# EAGLE board v1.0 (EAGLE 8.2.1), part 1 of 2
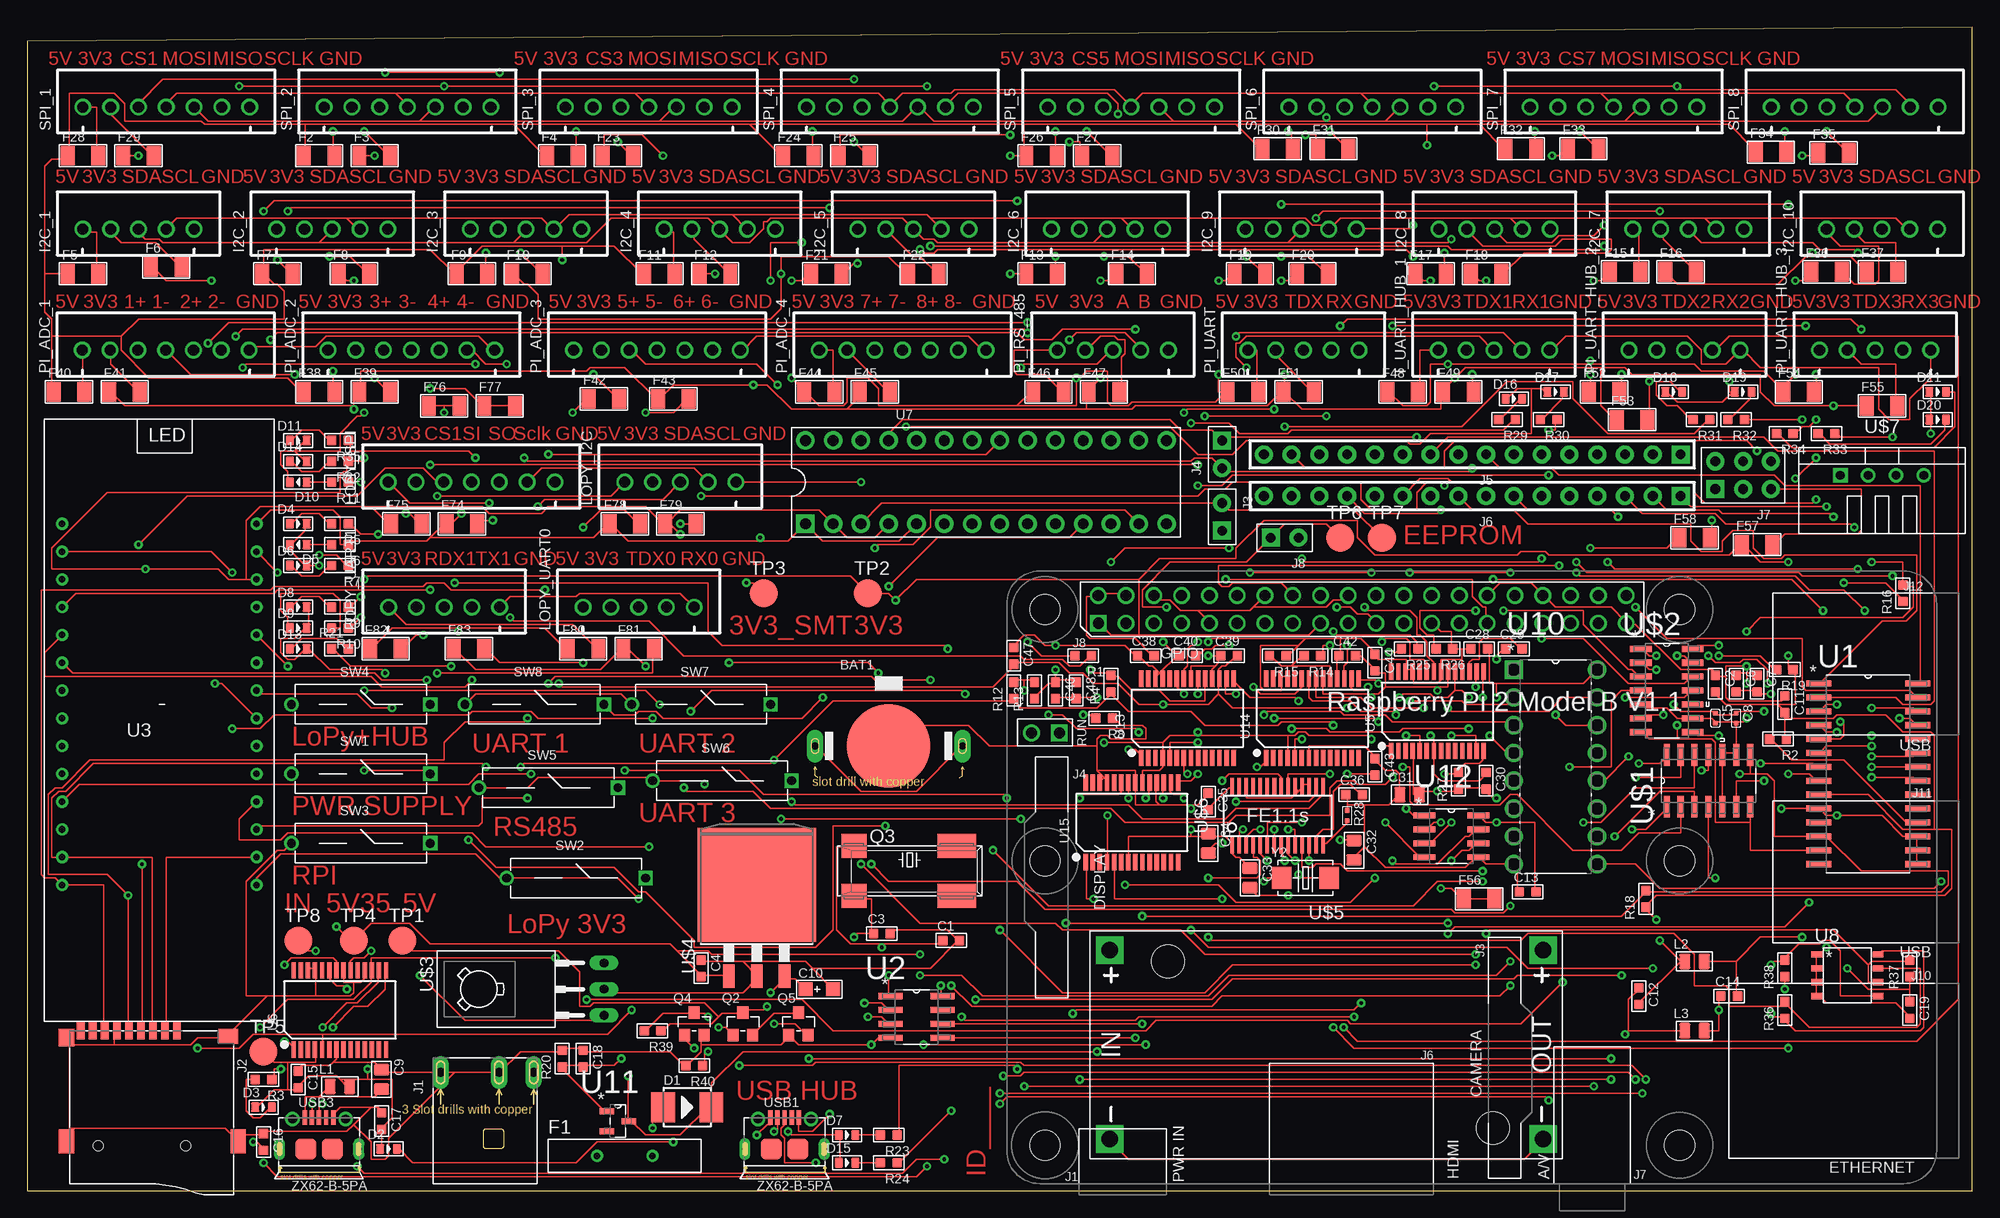
[diagram p9: board, top side]
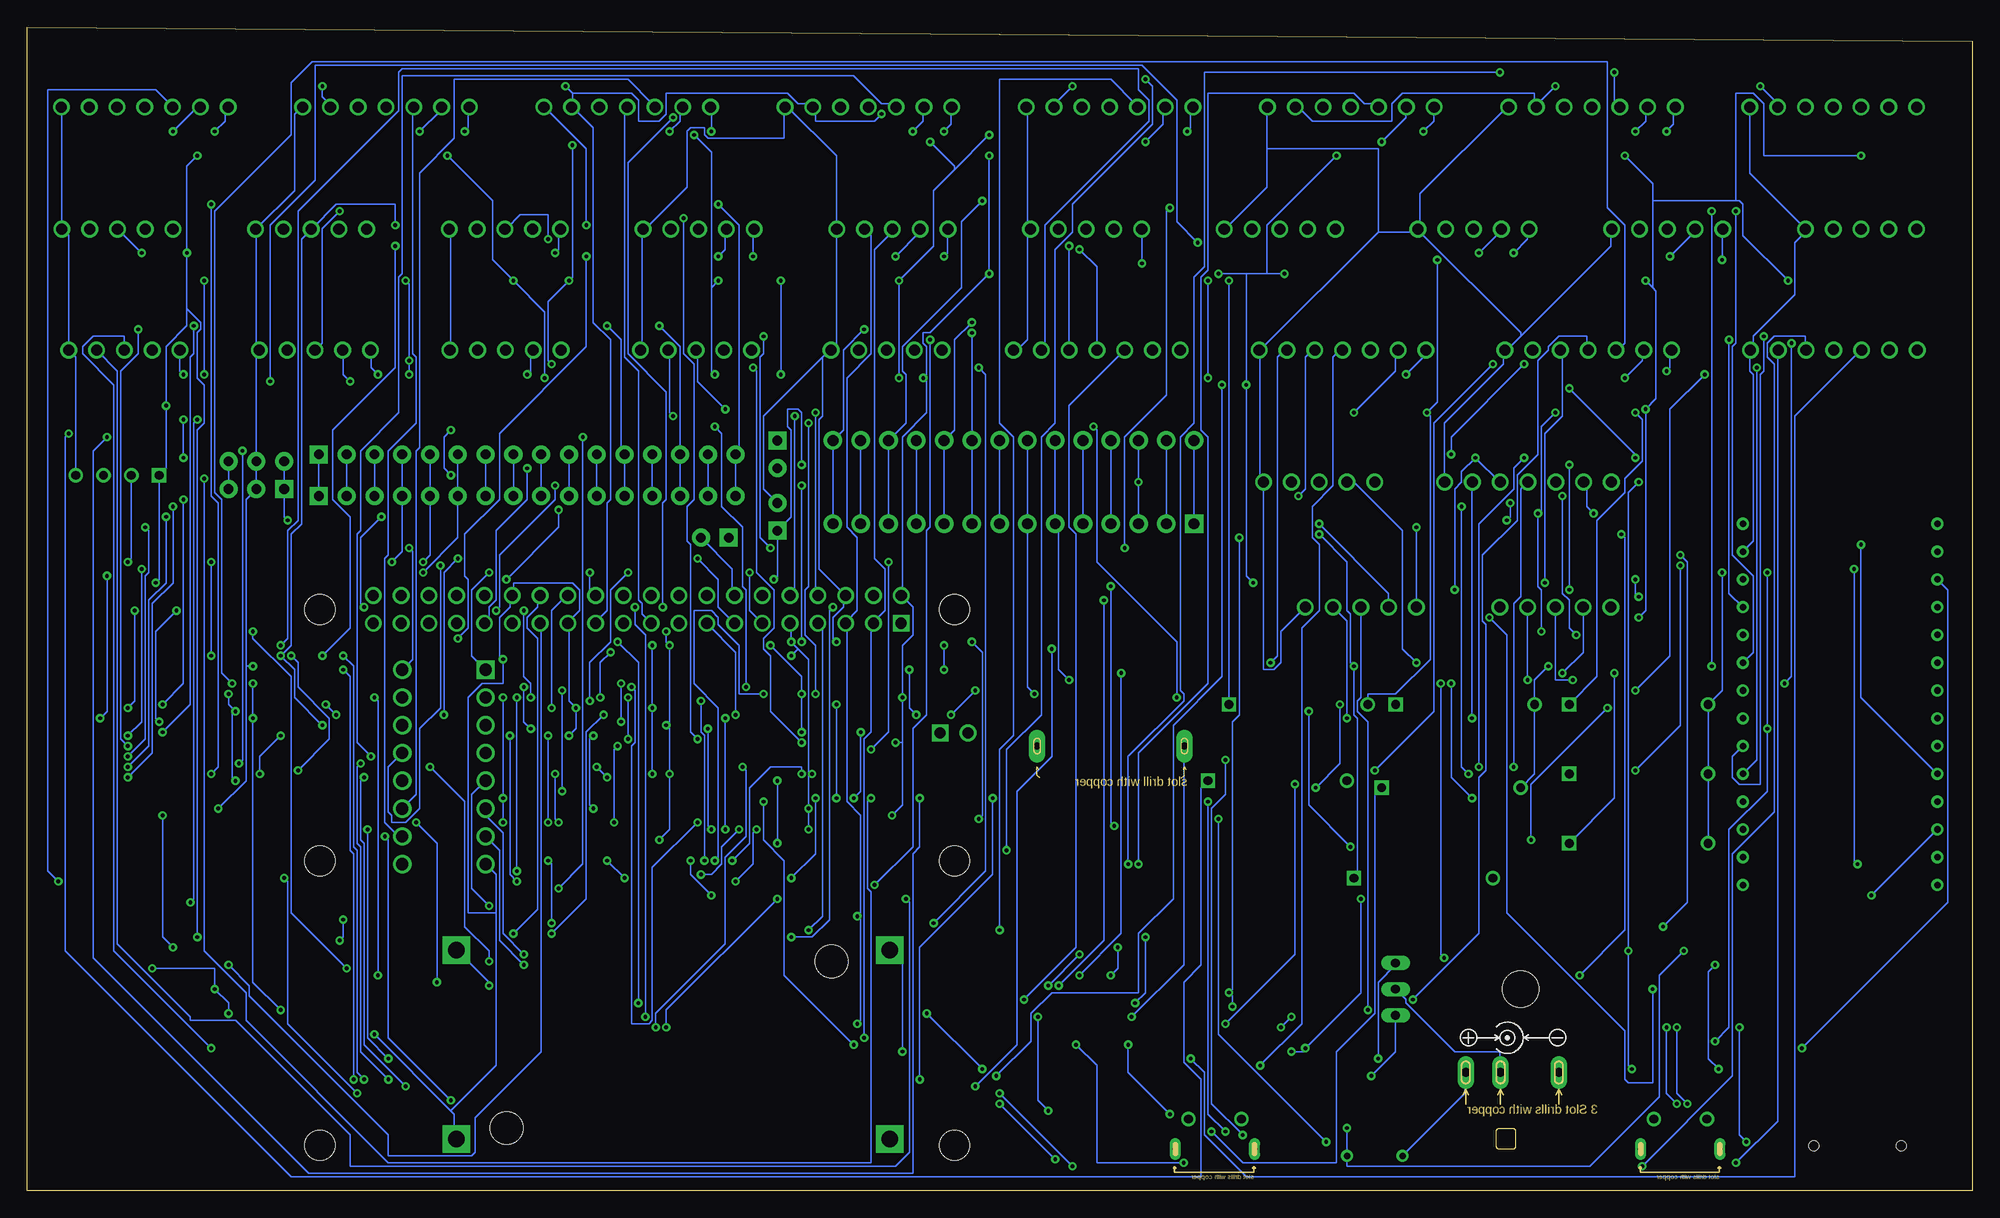
[diagram p10: board, bottom side, seen from below]

Size 177.78 x 106.35 mm. Coordinates in mm from the lower left corner, seen from the top.
Outline: 0,0 177.78,0 177.78,106.35 0,105.08 0,0
Copper layers (1*16): Top 0.035mm / dielectric 1.5mm / Bottom 0.035mm
Design rules "default": minimum track width 6mil, minimum drill 0.35mm, track to track 6mil, track to pad 6mil, pad to pad 6mil, via to via 6mil, smd to smd 6mil, copper to edge 40mil, drill to drill 6mil, minimum pad ring 10mil, minimum via ring 8mil, stop-mask expansion 4mil, vias tented up to drill 0mil, thermal gap 10mil

## Footprints (pad centres in the part's own frame; a part is rotated, then mirrored left to right if it is on the bottom)
BAT2P-13.5-CR1220 = drill 0.635 pad 1.524 long: +1 6.731,0; +2 -6.731,0 | smd 7.62 x 7.62: - 0,0
C0603 = smd 0.889 x 0.889: 1 0,0.762; 2 0,-0.762
C0402 = smd 0.5 x 0.5: 1 0,0.463; 2 0,-0.463
C0805 = smd 1.397 x 1.016: 1 0,0.889; 2 0,-0.889
AVX-A = smd 1.27 x 1.27: + -1.27,0; - 1.27,0
DO-214AA = smd 2.159 x 2.743: + -2.21,0; - 2.21,0
LED-0603 = smd 0.762 x 0.889: + -0.762,0; - 0.762,0
TH_5MM_14MM = drill 0.6: P$1 -2.54,0; P$2 2.54,0
F1206 = smd 1.27 x 1.778: 1 -1.397,0; 2 1.397,0
JST-XH-05-PACKAGE-ROUND-PAD = drill 1.016: 1 -5.08,0; 2 -2.54,0; 3 0,0; 4 2.54,0; 5 5.08,0
DCJ3P-11.6X9.6X7.0MM = drill 0.813 pad 1.524 long: + 4.381,10.16; - -4.128,10.16; CDN 1.206,10.16
MICRO-SD9+4P-SMD-16.1X14.5X1.85MM = smd 1.6 x 0.7: 1 0,2.25; 2 0,1.15; 3 0,0.05; 4 0,-1.05; 5 0,-2.15; 6 0,-3.25; 7 0,-4.35; 8 0,-5.45; 9 0,-6.55 | smd 1.6 x 1.4: G1 0.6,-7.85 | smd 2.2 x 1.4: G2 10.1,-7.85; G3 10.1,7.85 | smd 1.4 x 1.8: G4 0.5,6.95 | hole 0.9: 10.5,-4.95; 10.5,3.05
H2-2.54 = drill 0.889 pad 1.651 square: 1 0,1.27 | drill 0.889 pad 1.651: 2 0,-1.27
H16-2.54 = drill 0.889 pad 1.651 square: 1 0,-19.05 | drill 0.889 pad 1.651: 2 0,-16.51; 3 0,-13.97; 4 0,-11.43; 5 0,-8.89; 6 0,-6.35; 7 0,-3.81; 8 0,-1.27; 9 0,1.27; 10 0,3.81; 11 0,6.35; 12 0,8.89; 13 0,11.43; 14 0,13.97; 15 0,16.51; 16 0,19.05
H2X3-2.54 = drill 0.889 pad 1.651 square: 1 -1.27,2.54 | drill 0.889 pad 1.651: 2 -1.27,0; 3 -1.27,-2.54; 4 1.27,-2.54; 5 1.27,0; 6 1.27,2.54
L0805 = smd 1.016 x 1.397: 1 -0.889,0; 2 0.889,0
JST-XH-07-PACKAGE-ROUND-PAD = drill 1.016: 1 -7.62,0; 2 -5.08,0; 3 -2.54,0; 4 0,0; 5 2.54,0; 6 5.08,0; 7 7.62,0
RPI2 = drill 1.016 square: P$1 8.37,51.23; P$41 4.8,41.2 | drill 1.016: P$2 8.357,53.772; P$3 10.897,51.232; P$4 10.897,53.772; P$5 13.437,51.232; P$6 13.437,53.772; P$7 15.977,51.232; P$8 15.977,53.772; P$9 18.517,51.232; P$10 18.517,53.772; P$11 21.057,51.232; P$12 21.057,53.772; P$13 23.597,51.232; P$14 23.597,53.772; P$15 26.137,51.232; P$16 26.137,53.772; P$17 28.677,51.232; P$18 28.677,53.772; P$19 31.217,51.232; P$20 31.217,53.772; P$21 33.757,51.232; P$22 33.757,53.772; P$23 36.297,51.232; P$24 36.297,53.772; P$25 38.837,51.232; P$26 38.837,53.772; P$27 41.377,51.232; P$28 41.377,53.772; P$29 43.917,51.232; P$30 43.917,53.772; P$31 46.457,51.232; P$32 46.457,53.772; P$33 48.997,51.232; P$34 48.997,53.772; P$35 51.537,51.232; P$36 51.537,53.772; P$37 54.077,51.232; P$38 54.077,53.772; P$39 56.617,51.232; P$40 56.617,53.772; P$42 2.26,41.2 | hole 2.75: 3.5,3.5; 61.5,3.5; 3.5,52.5; 61.5,52.5; 61.5,29.5; 3.5,29.5
SOT-23 = smd 1.016 x 1.143: 1 -0.889,-1.016; 2 0.889,-1.016; 3 0,1.016
86SMX = smd 2.286 x 2.184: 1 -5.08,-2.286; 4 -5.08,2.286 | smd 3.556 x 2.184: 2 4.318,-2.286; 3 4.318,2.286
R0603 = smd 0.889 x 0.889: 1 0,0.762; 2 0,-0.762
R0402 = smd 0.5 x 0.5: 1 0,0.463; 2 0,-0.463
SW2-12.7-12.0X3.6X3.6MM = drill 0.8 square: 1 6.35,0 | drill 0.8: 2 -6.35,0
B2,54 = smd 2.54 x 2.54: TP 0,0
SOIC127P1032X265-28N = smd 2.286 x 0.559: 1 -4.521,8.255; 2 -4.521,6.985; 3 -4.521,5.715; 4 -4.521,4.445; 5 -4.521,3.175; 6 -4.521,1.905; 7 -4.521,0.635; 8 -4.521,-0.635; 9 -4.521,-1.905; 10 -4.521,-3.175; 11 -4.521,-4.445; 12 -4.521,-5.715; 13 -4.521,-6.985; 14 -4.521,-8.255; 15 4.521,-8.255; 16 4.521,-6.985; 17 4.521,-5.715; 18 4.521,-4.445; 19 4.521,-3.175; 20 4.521,-1.905; 21 4.521,-0.635; 22 4.521,0.635; 23 4.521,1.905; 24 4.521,3.175; 25 4.521,4.445; 26 4.521,5.715; 27 4.521,6.985; 28 4.521,8.255
SOIC127P600X175-8N = smd 2.184 x 0.559: 1 -2.362,1.905; 2 -2.362,0.635; 3 -2.362,-0.635; 4 -2.362,-1.905; 5 2.362,-1.905; 6 2.362,-0.635; 7 2.362,0.635; 8 2.362,1.905
LOPY = drill 0.6: P$1 -8.89,16.51; P$2 -8.89,13.97; P$3 -8.89,11.43; P$4 -8.89,8.89; P$5 -8.89,6.35; P$6 -8.89,3.81; P$7 -8.89,1.27; P$8 -8.89,-1.27; P$9 -8.89,-3.81; P$10 -8.89,-6.35; P$11 -8.89,-8.89; P$12 -8.89,-11.43; P$13 -8.89,-13.97; P$14 -8.89,-16.51; P$15 8.89,-16.51; P$16 8.89,-13.97; P$17 8.89,-11.43; P$18 8.89,-8.89; P$19 8.89,-6.35; P$20 8.89,-3.81; P$21 8.89,-1.27; P$22 8.89,1.27; P$23 8.89,3.81; P$24 8.89,6.35; P$25 8.89,8.89; P$26 8.89,11.43; P$27 8.89,13.97; P$28 8.89,16.51
SSOP28-0.65-10.2X5.2MM = smd 0.4 x 1.5: 1 -4.225,-3.625; 2 -3.575,-3.625; 3 -2.925,-3.625; 4 -2.275,-3.625; 5 -1.625,-3.625; 6 -0.975,-3.625; 7 -0.325,-3.625; 8 0.325,-3.625; 9 0.975,-3.625; 10 1.625,-3.625; 11 2.275,-3.625; 12 2.925,-3.625; 13 3.575,-3.625; 14 4.225,-3.625; 15 4.225,3.625; 16 3.575,3.625; 17 2.925,3.625; 18 2.275,3.625; 19 1.625,3.625; 20 0.975,3.625; 21 0.325,3.625; 22 -0.325,3.625; 23 -0.975,3.625; 24 -1.625,3.625; 25 -2.275,3.625; 26 -2.925,3.625; 27 -3.575,3.625; 28 -4.225,3.625
SCK28-2.54-35.6X10MM = drill 1 pad 1.7 square: 1 -16.51,-3.81 | drill 1 pad 1.7: 2 -13.97,-3.81; 3 -11.43,-3.81; 4 -8.89,-3.81; 5 -6.35,-3.81; 6 -3.81,-3.81; 7 -1.27,-3.81; 8 1.27,-3.81; 9 3.81,-3.81; 10 6.35,-3.81; 11 8.89,-3.81; 12 11.43,-3.81; 13 13.97,-3.81; 14 16.51,-3.81; 15 16.51,3.81; 16 13.97,3.81; 17 11.43,3.81; 18 8.89,3.81; 19 6.35,3.81; 20 3.81,3.81; 21 1.27,3.81; 22 -1.27,3.81; 23 -3.81,3.81; 24 -6.35,3.81; 25 -8.89,3.81; 26 -11.43,3.81; 27 -13.97,3.81; 28 -16.51,3.81
SOP8 = smd 1 x 0.5: 1 -2.8,1.905; 2 -2.8,0.635; 3 -2.8,-0.635; 4 -2.8,-1.905; 5 2.8,-1.905; 6 2.8,-0.635; 7 2.8,0.635; 8 2.8,1.905
DIP254P762X420-16 = drill 1.118 square: 1 -7.62,17.78 | drill 1.118: 2 -7.62,15.24; 3 -7.62,12.7; 4 -7.62,10.16; 5 -7.62,7.62; 6 -7.62,5.08; 7 -7.62,2.54; 8 -7.62,0; 9 0,0; 10 0,2.54; 11 0,5.08; 12 0,7.62; 13 0,10.16; 14 0,12.7; 15 0,15.24; 16 0,17.78
SOT91P240X110-3N = smd 1.321 x 0.559: 1 -1.016,0.914; 2 -1.016,-0.914; 3 1.016,0
SOIC127P600X175-8N' = smd 1.981 x 0.533: 1 -2.464,1.905; 2 -2.464,0.635; 3 -2.464,-0.635; 4 -2.464,-1.905; 5 2.464,-1.905; 6 2.464,-0.635; 7 2.464,0.635; 8 2.464,1.905
SOIC127P600X175-14N = smd 1.981 x 0.559: 1 -2.362,3.81; 2 -2.362,2.54; 3 -2.362,1.27; 4 -2.362,0; 5 -2.362,-1.27; 6 -2.362,-2.54; 7 -2.362,-3.81; 8 2.362,-3.81; 9 2.362,-2.54; 10 2.362,-1.27; 11 2.362,0; 12 2.362,1.27; 13 2.362,2.54; 14 2.362,3.81
TO-225AA = drill 0.813 long: 1 -4.921,-8.89; 2 -2.54,-8.89; 3 -0.159,-8.89 | hole 3.302: -2.54,2.54
TO-263 = smd 1.067 x 2.159: 1 -2.54,-8.331; 2 0,-8.331; 3 2.54,-8.331 | smd 10.8 x 10.41: TAB 0,0
DC-DC-STEP-DOWN-LM2596 = drill 1.5 pad 2.5 square: IN+ -19.812,8.636; IN- -19.812,-8.636; OUT+ 19.812,8.636; OUT- 19.812,-8.636 | hole 3: -14.478,7.62; 15.24,-7.62
FE1.1S_SSOP-28 = smd 0.35 x 1.5: 1 -4.16,-2.7; 2 -3.52,-2.7; 3 -2.88,-2.7; 4 -2.24,-2.7; 5 -1.6,-2.7; 6 -0.96,-2.7; 7 -0.32,-2.7; 8 0.32,-2.7; 9 0.96,-2.7; 10 1.6,-2.7; 11 2.24,-2.7; 12 2.88,-2.7; 13 3.52,-2.7; 14 4.16,-2.7; 15 4.16,2.7; 16 3.52,2.7; 17 2.88,2.7; 18 2.24,2.7; 19 1.6,2.7; 20 0.96,2.7; 21 0.32,2.7; 22 -0.3,2.7; 23 -0.96,2.7; 24 -1.6,2.7; 25 -2.24,2.7; 26 -2.88,2.7; 27 -3.52,2.7; 28 -4.16,2.7
TEMP-HUM-SENSOR-DHT22 = drill 0.8 square: 1 -3.81,0 | drill 0.8: 2 -1.27,0; 3 1.27,0; 4 3.81,0
MICRO-USB5+6P-SMD-0.65-AB = smd 0.4 x 1.35: 1 -1.3,2.875; 2 -0.65,2.875; 3 0,2.875; 4 0.65,2.875; 5 1.3,2.875 | smd 1.9 x 1.9: P1 -1.2,0; P2 1.2,0 | drill 0.508 pad 1.016 long: P3 -3.625,0; P4 3.625,0 | drill 0.8: P5 -2.425,2.73; P6 2.425,2.73
X2-SMD-5.0X3.2X1.3MM = smd 1.778 x 2.032: 1 -2.159,0; 2 2.159,0

## Placement (x,y rotation side)
BAT1  cr1220  [BAT2P-13.5-CR1220]  78.74,40.64 0 top
C1  10pf  [C0603]  84.45,22.86 90 top
C2  100nf  [C0603]  154.31,46.35 0 top
C3  10pf  [C0603]  78.11,23.5 90 top
C4  10uf  [C0603]  61.59,20.32 0 top
C5  1UF 6.3V  [C0402]  154.31,43.18 0 top
C6  100nf  [C0603]  156.21,46.35 0 top
C7  100nf  [C0603]  158.12,46.35 0 top
C8  1UF 6.3V  [C0402]  156.21,43.18 0 top
C9  10nf  [C0805]  32.38,10.16 0 top
C10  10uf  [AVX-A]  72.39,18.41 0 top
C11  100nf  [C0603]  160.66,44.45 0 top
C12  100nf  [C0603]  147.32,17.78 0 top
C13  100nf  [C0603]  137.16,27.3 90 top
C14  100nf  [C0603]  155.57,17.78 90 top
C15  100nf  [C0603]  24.77,10.16 0 top
C16  100nf  [C0603]  21.59,4.45 0 top
C17  4.7uf  [C0603]  32.38,6.35 0 top
C18  100nf  [C0603]  50.8,12.06 0 top
C19  100nf  [C0603]  172.09,16.51 0 top
C28  100nf  [C0603]  132.72,49.53 90 top
C29  100nf  [C0603]  135.89,49.53 90 top
C30  4.7uf  [C0603]  133.35,37.47 0 top
C31  100nf  [C0805]  126.36,36.2 90 top
C32  10uf  [C0805]  121.28,31.11 0 top
C33  10uf  [C0805]  111.76,28.57 0 top
C34  10uf  [C0805]  107.95,31.75 0 top
C35  100nf  [C0603]  107.95,35.56 0 top
C36  100nf  [C0603]  121.28,36.2 90 top
C38  100nf  [C0603]  102.23,48.9 90 top
C39  100nf  [C0603]  109.86,48.9 90 top
C40  4.7uf  [C0603]  106.05,48.9 90 top
C42  100nf  [C0603]  120.65,48.9 90 top
C43  100nf  [C0603]  123.19,38.73 0 top
C44  4.7uf  [C0603]  123.19,48.26 0 top
C46  100nf  [C0603]  93.98,45.72 0 top
C47  100nf  [C0603]  90.17,48.9 0 top
C48  4.7uf  [C0603]  95.89,45.72 0 top
D1  28V-5A  [DO-214AA]  60.33,7.62 0 top
D2  BLUE-0603  [LED-0603]  33.02,3.81 0 top
D3  GREEN-0603  [LED-0603]  21.59,7.62 0 top
D4  RED-0603  [LED-0603]  24.77,60.96 0 top
D5  RED-0603  [LED-0603]  24.77,59.05 180 top
D6  RED-0603  [LED-0603]  24.77,57.15 0 top
D7  BLUE-0603  [LED-0603]  74.93,5.08 0 top
D8  RED-0603  [LED-0603]  24.77,53.34 0 top
D9  RED-0603  [LED-0603]  24.77,51.44 0 top
D10  RED-0603  [LED-0603]  24.77,64.77 180 top
D11  BLUE-0603  [LED-0603]  24.77,68.58 0 top
D13  RED-0603  [LED-0603]  24.77,49.53 0 top
D14  RED-0603  [LED-0603]  24.77,66.67 0 top
D15  GREEN-0603  [LED-0603]  74.93,2.54 0 top
D16  BLUE-0603  [LED-0603]  135.89,72.39 0 top
D17  GREEN-0603  [LED-0603]  139.7,73.03 0 top
D18  BLUE-0603  [LED-0603]  150.5,73.03 0 top
D19  GREEN-0603  [LED-0603]  156.84,73.03 0 top
D20  BLUE-0603  [LED-0603]  174.62,70.48 0 top
D21  GREEN-0603  [LED-0603]  174.62,73.03 0 top
F1  307010005_DIP_PPTC_4A_0310  [TH_5MM_14MM]  54.61,3.17 0 top
F2  SMD1206R500SF  [F1206]  26.67,94.61 0 top
F3  SMD1206R500SF  [F1206]  31.75,94.61 0 top
F4  SMD1206R500SF  [F1206]  48.9,94.61 0 top
F5  SMD1206R500SF  [F1206]  5.08,83.82 0 top
F6  SMD1206R500SF  [F1206]  12.7,84.45 0 top
F7  SMD1206R500SF  [F1206]  22.86,83.82 0 top
F8  SMD1206R500SF  [F1206]  29.84,83.82 0 top
F9  SMD1206R500SF  [F1206]  40.64,83.82 0 top
F10  SMD1206R500SF  [F1206]  45.72,83.82 0 top
F11  SMD1206R500SF  [F1206]  57.78,83.82 0 top
F12  SMD1206R500SF  [F1206]  62.87,83.82 0 top
F13  SMD1206R500SF  [F1206]  92.71,83.82 0 top
F14  SMD1206R500SF  [F1206]  100.97,83.82 0 top
F15  SMD1206R500SF  [F1206]  146.05,83.99 0 top
F16  SMD1206R500SF  [F1206]  151.13,83.99 0 top
F17  SMD1206R500SF  [F1206]  128.27,83.82 0 top
F18  SMD1206R500SF  [F1206]  133.35,83.82 0 top
F19  SMD1206R500SF  [F1206]  111.76,83.82 0 top
F20  SMD1206R500SF  [F1206]  117.47,83.82 0 top
F21  SMD1206R500SF  [F1206]  73.03,83.82 0 top
F22  SMD1206R500SF  [F1206]  81.92,83.82 0 top
F23  SMD1206R500SF  [F1206]  53.98,94.61 0 top
F24  SMD1206R500SF  [F1206]  70.48,94.61 0 top
F25  SMD1206R500SF  [F1206]  75.56,94.61 0 top
F26  SMD1206R500SF  [F1206]  92.71,94.61 0 top
F27  SMD1206R500SF  [F1206]  97.79,94.61 0 top
F28  SMD1206R500SF  [F1206]  5.08,94.61 0 top
F29  SMD1206R500SF  [F1206]  10.16,94.61 0 top
F30  SMD1206R500SF  [F1206]  114.3,95.25 0 top
F31  SMD1206R500SF  [F1206]  119.38,95.25 0 top
F32  SMD1206R500SF  [F1206]  136.53,95.25 0 top
F33  SMD1206R500SF  [F1206]  142.24,95.25 0 top
F34  SMD1206R500SF  [F1206]  159.38,94.95 0 top
F35  SMD1206R500SF  [F1206]  165.1,94.87 0 top
F36  SMD1206R500SF  [F1206]  164.47,83.99 0 top
F37  SMD1206R500SF  [F1206]  169.54,83.99 0 top
F38  SMD1206R500SF  [F1206]  26.67,73.03 0 top
F39  SMD1206R500SF  [F1206]  31.75,73.03 0 top
F40  SMD1206R500SF  [F1206]  3.81,73.03 0 top
F41  SMD1206R500SF  [F1206]  8.89,73.03 0 top
F42  SMD1206R500SF  [F1206]  52.7,72.39 0 top
F43  SMD1206R500SF  [F1206]  59.05,72.39 0 top
F44  SMD1206R500SF  [F1206]  72.39,73.03 0 top
F45  SMD1206R500SF  [F1206]  77.47,73.03 0 top
F46  SMD1206R500SF  [F1206]  93.34,73.03 0 top
F47  SMD1206R500SF  [F1206]  98.42,73.03 0 top
F48  SMD1206R500SF  [F1206]  125.73,73.03 0 top
F49  SMD1206R500SF  [F1206]  130.81,73.03 0 top
F50  SMD1206R500SF  [F1206]  111.12,73.03 0 top
F51  SMD1206R500SF  [F1206]  116.2,73.03 0 top
F52  SMD1206R500SF  [F1206]  144.15,73.03 0 top
F53  SMD1206R500SF  [F1206]  146.69,70.48 0 top
F54  SMD1206R500SF  [F1206]  161.93,73.03 0 top
F55  SMD1206R500SF  [F1206]  169.54,71.75 0 top
F56  SMD1206R500SF  [F1206]  132.72,26.67 0 top
F57  SMD1206R500SF  [F1206]  158.12,59.05 0 top
F58  SMD1206R500SF  [F1206]  152.4,59.69 0 top
F74  SMD1206R500SF  [F1206]  39.73,60.96 0 top
F75  SMD1206R500SF  [F1206]  34.65,60.96 0 top
F76  SMD1206R500SF  [F1206]  38.1,71.75 0 top
F77  SMD1206R500SF  [F1206]  43.18,71.75 0 top
F78  SMD1206R500SF  [F1206]  54.61,60.96 0 top
F79  SMD1206R500SF  [F1206]  59.69,60.96 0 top
F80  SMD1206R500SF  [F1206]  50.8,49.53 0 top
F81  SMD1206R500SF  [F1206]  55.88,49.53 0 top
F82  SMD1206R500SF  [F1206]  32.75,49.53 0 top
F83  SMD1206R500SF  [F1206]  40.37,49.53 0 top
I2C_1  JST-XH-05-PIN-ROUND-PAD  [JST-XH-05-PACKAGE-ROUND-PAD]  10.16,87.9 0 top
I2C_2  JST-XH-05-PIN-ROUND-PAD  [JST-XH-05-PACKAGE-ROUND-PAD]  27.87,87.9 0 top
I2C_3  JST-XH-05-PIN-ROUND-PAD  [JST-XH-05-PACKAGE-ROUND-PAD]  45.58,87.9 0 top
I2C_4  JST-XH-05-PIN-ROUND-PAD  [JST-XH-05-PACKAGE-ROUND-PAD]  63.29,87.9 0 top
I2C_5  JST-XH-05-PIN-ROUND-PAD  [JST-XH-05-PACKAGE-ROUND-PAD]  81,87.9 0 top
I2C_6  JST-XH-05-PIN-ROUND-PAD  [JST-XH-05-PACKAGE-ROUND-PAD]  98.71,87.9 0 top
I2C_7  JST-XH-05-PIN-ROUND-PAD  [JST-XH-05-PACKAGE-ROUND-PAD]  151.84,87.9 0 top
I2C_8  JST-XH-05-PIN-ROUND-PAD  [JST-XH-05-PACKAGE-ROUND-PAD]  134.13,87.9 0 top
I2C_9  JST-XH-05-PIN-ROUND-PAD  [JST-XH-05-PACKAGE-ROUND-PAD]  116.42,87.9 0 top
I2C_10  JST-XH-05-PIN-ROUND-PAD  [JST-XH-05-PACKAGE-ROUND-PAD]  169.54,87.9 0 top
I_UART_HUB_1  JST-XH-05-PIN-ROUND-PAD  [JST-XH-05-PACKAGE-ROUND-PAD]  134.07,76.83 0 top
J1  DC-044-A  [DCJ3P-11.6X9.6X7.0MM]  41.91,0.64 0 top
J2  MICROSD-9P  [MICRO-SD9+4P-SMD-16.1X14.5X1.85MM]  11.43,14.61 270 top
J3  2p-2.54  [H2-2.54]  109.22,61.59 180 top
J4  2p-2.54  [H2-2.54]  109.22,67.31 0 top
J5  16p-2.54  [H16-2.54]  132.08,67.31 90 top
J6  16p-2.54  [H16-2.54]  132.08,63.5 90 top
J7  2x3p-2.54  [H2X3-2.54]  156.84,65.41 90 top
J8  2p-2.54  [H2-2.54]  114.94,59.69 90 top
L1  330R-1500MA  [L0805]  28.57,9.53 0 top
L2  330R-1500MA  [L0805]  152.4,20.95 0 top
L3  330R-1500MA  [L0805]  152.4,14.61 0 top
LOPY_I2C  JST-XH-05-PIN-ROUND-PAD  [JST-XH-05-PACKAGE-ROUND-PAD]  59.69,64.77 0 top
LOPY_SPI  JST-XH-07-PIN-ROUND-PAD  [JST-XH-07-PACKAGE-ROUND-PAD]  40.6,64.77 0 top
LOPY_UART0  JST-XH-05-PIN-ROUND-PAD  [JST-XH-05-PACKAGE-ROUND-PAD]  55.88,53.34 0 top
LOPY_UART1  JST-XH-05-PIN-ROUND-PAD  [JST-XH-05-PACKAGE-ROUND-PAD]  38.1,53.34 0 top
PCB1  RPI2  [RPI2]  89.53,0.64 0 top
PI_ADC_1  JST-XH-07-PIN-ROUND-PAD  [JST-XH-07-PACKAGE-ROUND-PAD]  12.64,76.83 0 top
PI_ADC_2  JST-XH-07-PIN-ROUND-PAD  [JST-XH-07-PACKAGE-ROUND-PAD]  35.1,76.83 0 top
PI_ADC_3  JST-XH-07-PIN-ROUND-PAD  [JST-XH-07-PACKAGE-ROUND-PAD]  57.55,76.83 0 top
PI_ADC_4  JST-XH-07-PIN-ROUND-PAD  [JST-XH-07-PACKAGE-ROUND-PAD]  80.01,76.83 0 top
PI_RS_485  JST-XH-05-PIN-ROUND-PAD  [JST-XH-05-PACKAGE-ROUND-PAD]  99.24,76.83 0 top
PI_UART  JST-XH-05-PIN-ROUND-PAD  [JST-XH-05-PACKAGE-ROUND-PAD]  116.66,76.83 0 top
PI_UART_HUB_2  JST-XH-05-PIN-ROUND-PAD  [JST-XH-05-PACKAGE-ROUND-PAD]  151.49,76.83 0 top
PI_UART_HUB_3  JST-XH-05-PIN-ROUND-PAD  [JST-XH-05-PACKAGE-ROUND-PAD]  168.91,76.83 0 top
Q2  SSM3J328R,LF  [SOT-23]  65.41,15.24 0 top
Q3  6pF@32.7680kHz  [86SMX]  80.64,29.21 0 top
Q4  BSS138W-7-F  [SOT-23]  60.96,15.24 0 top
Q5  SSM3J328R,LF  [SOT-23]  70.48,15.24 0 top
R1  330R  [R0603]  96.52,48.9 90 top
R2  10K 1/10W  [R0603]  160.02,41.27 90 top
R3  330R  [R0603]  21.59,10.16 90 top
R4  4.7K  [R0603]  99.06,46.35 0 top
R5  1K  [R0603]  28.57,60.96 90 top
R6  220R  [R0603]  28.57,59.05 90 top
R7  330R  [R0603]  28.57,57.15 90 top
R8  10K  [R0603]  98.42,43.18 90 top
R9  100R  [R0603]  28.57,53.34 90 top
R10  100R  [R0603]  28.57,51.44 90 top
R11  1K  [R0603]  28.57,64.77 90 top
R12  4.7K  [R0603]  90.17,45.72 0 top
R13  10K  [R0603]  92.08,45.72 0 top
R14  4.7K  [R0603]  117.47,48.9 90 top
R15  10K  [R0603]  114.3,48.9 90 top
R16  10K  [R0603]  171.45,54.61 0 top
R18  10K  [R0603]  147.96,26.67 0 top
R19  10K  [R0603]  160.66,47.62 90 top
R20  15K 1/10W  [R0603]  48.9,12.06 0 top
R21  220R  [R0603]  28.57,49.53 270 top
R22  100R  [R0603]  28.57,66.67 90 top
R23  330R  [R0603]  78.74,5.08 90 top
R24  330R  [R0603]  78.74,2.54 90 top
R25  4.7K  [R0603]  126.36,49.53 90 top
R26  10K  [R0603]  129.54,49.53 90 top
R27  10K  [R0603]  130.81,37.47 0 top
R28  2.7K 1/16W  [R0402]  120.65,34.29 0 top
R29  330R  [R0603]  135.25,70.48 90 top
R30  330R  [R0603]  139.06,70.48 90 top
R31  330R  [R0603]  153.03,70.48 90 top
R32  330R  [R0603]  156.21,70.48 90 top
R33  330R  [R0603]  164.47,69.22 90 top
R34  330R  [R0603]  160.66,69.22 90 top
R35  1K  [R0603]  28.57,68.58 90 top
R36  1M  [R0603]  160.66,16.51 0 top
R37  3.9K  [R0603]  172.09,20.32 0 top
R38  3.9K  [R0603]  160.66,20.32 0 top
R39  100K 1/10W  [R0603]  57.15,14.61 90 top
R40  100K 1/10W  [R0603]  60.96,11.43 90 top
SPI_1  JST-XH-07-PIN-ROUND-PAD  [JST-XH-07-PACKAGE-ROUND-PAD]  12.7,99.06 0 top
SPI_2  JST-XH-07-PIN-ROUND-PAD  [JST-XH-07-PACKAGE-ROUND-PAD]  34.75,99.06 0 top
SPI_3  JST-XH-07-PIN-ROUND-PAD  [JST-XH-07-PACKAGE-ROUND-PAD]  56.8,99.06 0 top
SPI_4  JST-XH-07-PIN-ROUND-PAD  [JST-XH-07-PACKAGE-ROUND-PAD]  78.85,99.06 0 top
SPI_5  JST-XH-07-PIN-ROUND-PAD  [JST-XH-07-PACKAGE-ROUND-PAD]  100.9,99.06 0 top
SPI_6  JST-XH-07-PIN-ROUND-PAD  [JST-XH-07-PACKAGE-ROUND-PAD]  122.95,99.06 0 top
SPI_7  JST-XH-07-PIN-ROUND-PAD  [JST-XH-07-PACKAGE-ROUND-PAD]  145,99.06 0 top
SPI_8  JST-XH-07-PIN-ROUND-PAD  [JST-XH-07-PACKAGE-ROUND-PAD]  167.04,99.06 0 top
SW1  SW-200D  [SW2-12.7-12.0X3.6X3.6MM]  30.48,38.1 0 top
SW2  SW-200D  [SW2-12.7-12.0X3.6X3.6MM]  50.16,28.57 0 top
SW3  SW-200D  [SW2-12.7-12.0X3.6X3.6MM]  30.48,31.75 0 top
SW4  SW-200D  [SW2-12.7-12.0X3.6X3.6MM]  30.48,44.45 0 top
SW5  SW-200D  [SW2-12.7-12.0X3.6X3.6MM]  47.62,36.83 0 top
SW6  SW-200D  [SW2-12.7-12.0X3.6X3.6MM]  63.5,37.47 0 top
SW7  SW-200D  [SW2-12.7-12.0X3.6X3.6MM]  61.59,44.45 0 top
SW8  SW-200D  [SW2-12.7-12.0X3.6X3.6MM]  46.35,44.45 0 top
TP1  TPB2,54  [B2,54]  34.29,22.86 0 top
TP2  TPB2,54  [B2,54]  76.83,54.61 0 top
TP3  TPB2,54  [B2,54]  67.31,54.61 0 top
TP4  TPB2,54  [B2,54]  29.84,22.86 0 top
TP5  TPB2,54  [B2,54]  21.59,12.7 0 top
TP6  TPB2,54  [B2,54]  120.02,59.69 0 top
TP7  TPB2,54  [B2,54]  123.83,59.69 0 top
TP8  TPB2,54  [B2,54]  24.77,22.86 0 top
U1  MCP23017-E/SO  [SOIC127P1032X265-28N]  168.28,38.1 0 top
U2  MCP79412-I/SN  [SOIC127P600X175-8N]  81.28,15.88 0 top
U3  LOPY  [LOPY]  12.06,44.45 0 top
U5  FT232RL-SSOP28  [SSOP28-0.65-10.2X5.2MM]  128.91,43.81 0 top
U6  FT232RL-SSOP28  [SSOP28-0.65-10.2X5.2MM]  28.57,16.51 0 top
U7  2x14p-2.54  [SCK28-2.54-35.6X10MM]  87.63,64.77 0 top
U8  BR24G32-3  [SOP8]  166.37,19.68 0 top
U10  74HC139N  [DIP254P762X420-16]  143.51,29.84 0 top
U11  BZX84C30  [SOT91P240X110-3N]  53.98,6.35 0 top
U12  SP483ECN-L  [SOIC127P600X175-8N']  130.18,32.38 0 top
U13  FT232RL-SSOP28  [SSOP28-0.65-10.2X5.2MM]  106.05,43.18 0 top
U14  FT232RL-SSOP28  [SSOP28-0.65-10.2X5.2MM]  117.47,43.18 0 top
U15  FT232RL-SSOP28  [SSOP28-0.65-10.2X5.2MM]  100.97,33.66 0 top
U$1  MCP3424-E/SL  [SOIC127P600X175-14N]  153.67,37.47 90 top
U$2  MCP3424-E/SL  [SOIC127P600X175-14N]  149.86,45.72 0 top
U$3  C106DG  [TO-225AA]  43.81,20.95 90 top
U$4  MCR29300  [TO-263]  66.67,27.94 0 top
U$5  DC-DC-STEP-DOWN-LM2596  [DC-DC-STEP-DOWN-LM2596]  118.75,13.34 0 top
U$6  FE1.1S  [FE1.1S_SSOP-28]  114.3,34.29 0 top
U$7  TEMP-HUM-SENSOR-DHT22  [TEMP-HUM-SENSOR-DHT22]  169.54,65.41 0 top
USB1  ZX62-B-5PA  [MICRO-USB5+6P-SMD-0.65-AB]  69.22,3.81 0 top
USB3  ZX62-B-5PA  [MICRO-USB5+6P-SMD-0.65-AB]  26.67,3.81 0 top
Y2  12MHZ  [X2-SMD-5.0X3.2X1.3MM]  116.84,28.57 0 top

## Tracks (layer width: path | path; a pad name or v marks a point on that pad's centre or on a via)
3V3  (via drill 0.35)
  Top 0.152: R37.2 172.09,18.41 | 172.09,18.41 C19.1 | U8.8 169.23,21.59 169.54,21.91 173.35,21.91 173.35,14.92 173.04,14.61 161.61,14.61 160.66,15.56 R36.2 160.66,15.88 159.7,15.88 v159.38,16.19 | v160.66,18.41 R38.2 | 172.09,18.41 168.28,18.41 v166.37,20.32
  Bottom 0.152: v159.38,16.19 159.38,17.14 v160.66,18.41 160.66,20.32 v166.37,20.32
3V3_PROTECTED
  Top 0.152: J7.3 167.64,64.14 167.64,60.33 167.32,60.01 160.66,60.01 159.7,59.05 F57.2
  Bottom 0.152: J7.3 J7.4
3V3_SMOOTH  (via drill 0.35)
  Top 0.152: 163.19,85.41 166.69,85.41 167.96,84.14 F37.1 | 163.19,85.41 162.56,85.41 160.02,82.87 150.81,82.87 149.86,83.82 F16.1 | 156.21,20.95 156.21,17.78 C14.2 | L2.2 156.21,20.95 | v166.05,55.56 169.86,55.56 171.45,53.98 R16.2 | v162.24,94.61 163.51,94.61 F35.1 | 156.21,20.95 158.43,23.18 v162.24,23.18 | v163.19,85.72 163.19,85.41 | F10.1 44.45,83.82 45.4,82.87 45.72,82.87 46.67,81.92 46.67,79.69 67.94,79.69 68.9,80.64 v68.9,83.82 68.9,85.41 78.74,85.41 80.33,83.82 F22.1 | v62.87,83.82 F12.1 | v58.1,94.61 56.2,96.52 52.7,96.52 52.7,94.61 F23.1 | TP3.TP 66.36,55.56 v65.72,55.56 | v30.48,52.39 29.53,51.44 R10.2 | 29.84,71.75 29.84,73.03 F39.1 30.48,73.03 30.48,74.93 51.12,74.93 51.44,75.25 54.61,75.25 57.47,72.39 F43.1 57.78,72.39 59.05,73.66 v66.36,73.66 67.63,73.66 69.85,71.44 74.93,71.44 | 29.84,71.75 8.89,71.75 7.62,73.03 F41.1 | 29.84,71.75 v29.84,71.44 | v29.84,83.19 29.21,83.19 28.57,83.82 F8.1 | v16.83,83.19 12.7,83.19 11.43,84.45 F6.1 | v10.16,94.61 F29.1 | v31.75,94.61 F3.1 | 74.93,71.44 75.88,72.39 75.88,73.03 F45.1 | 96.84,71.44 96.84,73.03 | 74.93,71.44 96.84,71.44 | 96.84,71.44 100.97,71.44 101.28,71.75 113.35,71.75 114.62,73.03 F51.1 114.94,73.03 | v98.11,83.19 98.74,83.19 99.38,83.82 F14.1 | 96.84,73.03 v98.11,74.3 | 96.84,73.03 F47.1 | v89.85,96.52 74.3,96.52 74.3,94.61 F25.1 | v95.25,95.89 96.2,95.89 96.2,94.61 F27.1 | 129.22,73.03 129.22,71.44 116.52,71.44 114.94,73.03 | v114.62,83.19 115.25,83.19 115.89,83.82 F20.1 | 114.94,73.03 v114.94,74.61 | v133.35,83.19 132.72,83.19 132.08,83.82 F18.1 | 129.22,73.03 v130.49,74.3 131.44,75.25 143.83,75.25 | 129.22,73.03 F49.1 | 143.83,75.25 143.83,71.75 145.1,70.48 F53.1
  Top 0.152: v116.84,96.52 117.79,96.52 117.79,95.25 F31.1 | v139.38,94.61 140.02,94.61 140.65,95.25 F33.1 | F55.1 v165.1,71.75 159.7,71.75 158.43,73.03 158.43,74.61 146.69,74.61 146.05,75.25 143.83,75.25
  Bottom 0.152: v166.05,55.56 165.74,55.88 U$7.1 165.1,66.04 v165.1,71.75 165.1,77.15 163.19,79.06 163.19,80.64 | v162.24,94.61 163.19,93.66 v163.19,85.72 163.19,80.64 | v162.24,23.18 162.24,69.53 161.61,70.17 161.61,73.66 162.24,74.3 162.24,78.42 161.93,78.74 161.93,79.38 163.19,80.64 | v68.9,83.82 66.36,83.82 | 66.36,83.82 64.45,83.82 | 64.45,83.82 v62.87,83.82 | v58.1,94.61 64.45,88.27 64.45,83.82 | v65.72,55.56 66.36,56.2 v66.36,73.66 66.36,83.82 | v30.48,52.39 29.84,53.02 v29.84,71.44 28.89,72.39 28.89,82.23 29.21,82.55 | 29.21,82.55 v29.84,83.19 | v16.83,83.19 20.95,87.31 20.95,90.17 21.27,90.49 21.59,90.49 | 29.21,90.49 21.59,90.49 | 29.21,82.55 29.21,90.49 | v10.16,94.61 19.05,94.61 19.05,99.38 20,100.33 21.59,100.33 21.59,90.49 | v31.75,94.61 29.21,92.08 29.21,90.49 | v98.11,74.3 v98.11,83.19 94.93,86.36 94.93,91.44 93.03,93.34 | 93.03,93.34 v89.85,96.52 | v95.25,95.89 93.03,93.66 93.03,93.34 | 115.25,82.55 v114.62,83.19 | 115.25,82.55 115.25,74.93 v114.94,74.61 | v130.49,74.3 130.49,80.33 v133.35,83.19 135.25,85.09 135.25,90.49 v139.38,94.61 | v116.84,96.52 115.25,94.93 115.25,82.55
5V35  (via drill 0.35)
  Top 0.152: 61.59,19.68 64.14,19.68 U$4.1 | v26.67,58.1 28.26,58.1 29.21,57.15 R7.2 | v28.26,24.13 29.53,22.86 TP4.TP 31.43,24.45 34.92,24.45 36.83,22.54 58.74,22.54 59.37,21.91 | 59.37,21.91 61.59,19.68 | 61.59,19.68 C4.2 | v135.57,18.73 134.62,17.78 109.22,17.78 108.27,16.83 86.36,16.83 v84.45,18.73 | v81.6,21.59 62.55,21.59 62.23,21.91 59.37,21.91
  Bottom 0.152: v26.67,58.1 26.04,57.47 26.04,26.35 v28.26,24.13 | v135.57,18.73 135.57,19.05 138.43,21.91 U$5.OUT+ | v81.6,21.59 v84.45,18.73
5V_USB_HUB  (via drill 0.35)
  Top 0.152: v119.06,49.85 118.43,49.85 118.43,48.9 R14.2 | v119.38,51.12 119.7,50.8 126.36,50.8 127,50.16 127,49.53 R25.2 | v120.02,32.07 121.28,32.07 C32.1 | v119.06,38.1 115.25,38.1 115.25,37.15 U$6.20 | 90.17,44.77 90.81,44.13 97.79,44.13 99.06,45.4 | v40.96,66.99 40.32,67.63 29.53,67.63 29.53,68.58 R35.2 | v45.09,38.73 45.4,39.05 67.94,39.05 v68.26,39.37 73.66,44.77 90.17,44.77 | 90.17,44.77 R12.2 | v66.67,5.08 67.63,6.03 67.94,6.03 67.94,6.67 USB1.1 | v119.38,42.55 119.06,42.86 114.62,42.86 114.3,42.55 107.63,42.55 106.36,43.81 100.65,43.81 99.06,45.4 | 99.06,45.4 R4.2
  Bottom 0.152: v119.38,51.12 119.38,50.16 v119.06,49.85 119.06,42.55 | v120.02,32.07 119.06,33.02 v119.06,38.1 119.06,42.55 | v40.96,66.99 41.91,66.04 41.91,64.14 45.09,60.96 v45.09,38.73 | v66.67,5.08 69.53,7.94 69.53,34.92 68.26,36.2 v68.26,39.37 | v119.38,42.55 119.06,42.55
+3V3  (via drill 0.35)
  Top 0.152: 160.66,43.18 160.66,41.27 R2.2 | 160.66,43.18 C11.2 160.66,43.81 160.02,44.45 | 160.02,44.45 155.26,44.45 154.31,45.4 C2.2 | 160.02,44.45 161.61,44.45 161.61,47.62 R19.2 160.97,47.62 v160.97,48.9 | v160.97,57.47 158.43,57.47 156.84,59.05 F57.1 156.53,59.05 155.57,58.1 139.06,58.1 138.75,58.42 136.53,58.42 136.21,58.1 123.19,58.1 121.6,59.69 121.6,61.28 113.03,61.28 110.49,58.74 110.49,57.78 103.5,57.78 101.6,55.88 | 151.13,20.95 147.32,17.14 C12.2 | 151.13,20.95 L2.1 151.45,20.95 | 174.31,33.02 171.45,33.02 168.28,36.2 U1.9 | 174.31,33.02 175.9,33.02 175.9,27.62 175.26,26.99 148.91,26.99 147.96,26.04 R18.2 147.96,25.72 v148.91,24.77 | v149.22,22.86 151.13,20.95 | 160.66,43.18 165.1,43.18 165.42,43.5 169.86,43.5 171.45,41.91 173.99,41.91 174.31,41.59 174.31,33.02 | 101.6,50.8 117.16,50.8 118.11,51.75 PCB1.P$17 | 101.6,50.8 99.06,50.8 98.11,51.75 PCB1.P$1 | v30.48,54.29 29.53,53.34 R9.2 | v30.8,55.88 31.11,56.2 75.25,56.2 TP2.TP 78.74,54.61 v79.38,53.98 81.28,55.88 101.6,55.88 | v83.5,18.73 83.5,17.78 U2.8 | 101.6,55.88 101.6,50.8
  Bottom 0.152: v160.97,48.9 v160.97,57.47 | v149.22,22.86 148.91,23.18 v148.91,24.77 | v30.48,54.29 30.8,54.61 v30.8,55.88 | v83.5,18.73 79.38,22.86 v79.38,53.98
+3V3_SMOOTH  (via drill 0.35)
  Top 0.152: C6.2 156.21,45.72 158.12,45.72 C7.2 158.12,45.4 v159.38,45.4 | v158.75,43.81 156.21,43.81 C8.1 156.21,43.5 154.31,43.5 C5.1 154.31,43.81 151.13,43.81 v150.5,44.45 | U$1.6 156.21,37.47 v158.75,37.47 | v149.54,43.5 147.96,43.5 147.64,43.18 U$2.6
  Bottom 0.152: 159.07,44.13 159.38,44.45 v159.38,45.4 | 159.07,44.13 v158.75,43.81 | v158.75,37.47 159.07,37.78 159.07,44.13 | v150.5,44.45 v149.54,43.5
+5V  (via drill 0.35)
  Top 0.152: C10.+ 70.17,19.37 69.22,19.37 | 63.18,15.88 63.5,16.19 65.41,16.19 Q2.3 65.41,16.51 67.31,16.51 v67.63,16.83 | 63.18,15.88 62.55,15.24 58.74,15.24 58.1,14.61 R39.2 | TP1.TP 35.24,21.91 48.58,21.91 50.48,20 50.48,16.83 51.44,16.83 51.75,17.14 61.91,17.14 63.18,15.88 | v67.94,18.1 69.22,19.37 | 69.22,19.37 U$4.3 | U7.5 79.69,59.37 72.71,59.37 U7.1 69.53,59.37 66.99,59.37 | 39.37,51.44 47.31,51.44 49.21,49.53 F80.1 | 39.37,51.44 33.34,51.44 31.43,49.53 F82.1 | F76.2 38.1,71.75 | 38.1,71.75 F76.1 | 36.83,59.69 38.1,60.96 F74.1 38.73,60.96 v39.69,61.91 | 36.83,59.69 36.51,59.37 29.84,59.37 29.53,59.05 R6.2 28.57,59.05 28.57,61.59 27.94,62.23 22.23,62.23 U3.P$28 | 36.83,59.69 51.75,59.69 53.02,60.96 F78.1 53.34,60.96 54.93,59.37 66.99,59.37 | v38.1,71.12 38.1,71.75 | v39.37,51.12 39.37,51.44 | 66.99,59.37 v66.99,59.69
  Bottom 0.152: v67.63,16.83 67.63,17.78 v67.94,18.1 67.63,18.41 67.63,42.86 66.99,43.5 v66.99,59.69 | U7.28 U7.1 | U7.24 U7.5 | v38.1,71.12 39.37,69.85 39.37,62.23 v39.69,61.91 39.69,55.24 39.37,54.93 v39.37,51.12
+24V  (via drill 0.35)
  Top 0.152: v97.79,12.7 65.41,12.7 62.55,9.84 D1.- 62.23,7.62 59.69,5.08 56.52,5.08 55.24,6.35 U11.3 54.93,6.35 v54.93,10.48 | v32.07,60.01 30.48,60.01 29.53,60.96 R5.2 | v35.88,19.68 40.01,15.56 52.39,15.56 52.7,15.88 U$3.1
  Bottom 0.152: v97.79,12.7 97.79,20.95 98.74,21.91 U$5.IN+ | v32.07,60.01 31.75,59.69 31.75,23.81 v35.88,19.68 | v54.93,10.48 52.7,12.7 U$3.1
+24V_UNREG_IN
  Bottom 0.152: F1.P$1 46.35,8.89 46.35,10.79 J1.+
ADC1+  (via drill 0.35)
  Top 0.152: v146.69,33.02 147.96,33.02 149.86,34.92 U$1.1 | v71.44,12.06 v144.78,12.06
  Bottom 0.152: v146.69,33.02 146.69,13.97 v144.78,12.06 | v71.44,12.06 70.17,10.79 70.17,5.08 66.36,1.27 16.19,1.27 16.19,70.8 10.16,76.83 PI_ADC_1.3
ADC1-  (via drill 0.35)
  Top 0.152: U$1.2 151.13,32.7 147.32,32.7 145.73,31.11 141.29,31.11 136.21,36.2 135.57,36.2 134.62,35.24 126.68,35.24 126.36,35.56 126.36,38.73 v125.73,38.73 | v124.78,37.78 124.14,37.15 121.6,37.15 121.28,37.47 119.7,37.47 119.06,36.83 119.06,34.29 110.49,34.29 109.86,33.66 100.33,33.66 99.06,34.92 67.94,34.92 66.36,36.51 60.33,36.51 v60.01,36.83 | v57.78,44.45 56.52,45.72 v30.8,45.72 | v24.45,74.61 14.92,74.61 12.7,76.83 PI_ADC_1.4
  Bottom 0.152: v124.78,37.78 v125.73,38.73 | v60.01,36.83 57.78,39.05 v57.78,44.45 | v30.8,45.72 27.62,48.9 27.62,71.44 v24.45,74.61
ADC2+  (via drill 0.35)
  Top 0.152: U$1.3 152.4,36.51 149.22,36.51 v145.1,32.38 | v139.06,8.26 138.75,8.57 89.53,8.57 v88.9,7.94 | v83.82,2.86 81.28,2.86 80.01,1.59 30.8,1.59 v30.16,2.22
  Bottom 0.152: v145.1,32.38 144.78,32.07 144.78,13.97 v139.06,8.26 | v83.82,2.86 v88.9,7.94 | v30.16,2.22 21.91,10.48 21.91,30.8 18.1,34.61 18.1,75.56 18.73,76.2 18.73,77.47 18.1,78.11 15.24,78.11 15.24,76.83 PI_ADC_1.5
ADC2-  (via drill 0.35)
  Top 0.152: U$1.4 153.67,28.57 v154.31,28.57 | v88.9,8.89 v147.64,8.89 | v82.23,2.22 81.28,1.27 22.86,1.27 v21.59,2.54
  Bottom 0.152: v154.31,28.57 153.99,28.26 153.99,15.24 v147.64,8.89 | v82.23,2.22 v88.9,8.89 | v21.59,2.54 17.78,6.35 17.78,76.83 PI_ADC_1.6
ADC3+  (via drill 0.35)
  Top 0.152: U$1.11 153.67,38.42 v153.03,38.42 | v153.67,48.9 154.31,48.26 156.53,48.26 156.84,48.58 158.12,48.58 159.07,47.62 v159.07,46.35
  Bottom 0.152: v153.03,38.42 150.18,41.27 150.18,43.18 153.03,46.04 153.03,48.26 v153.67,48.9 | v159.07,46.35 160.02,47.31 160.02,63.18 160.66,63.82 160.66,89.53 153.67,96.52 153.67,101.28 151.76,103.19 33.34,103.19 33.34,89.85 31.75,88.27 31.75,77.47 32.38,76.83 PI_ADC_2.3
ADC3-  (via drill 0.35)
  Top 0.152: U$1.12 152.4,36.83 147,36.83 143.83,33.66 v142.24,33.66 | v140.34,19.05 136.53,15.24 120.97,15.24 120.65,15.56 103.19,15.56 102.23,14.61 73.66,14.61 70.8,17.46 v51.12,17.46
  Bottom 0.152: v142.24,33.66 140.34,31.75 v140.34,19.05 | v51.12,17.46 45.09,23.5 45.09,37.78 44.45,38.42 44.45,51.75 44.77,52.07 44.77,58.1 41.59,61.28 41.59,65.41 39.69,67.31 39.69,75.88 38.73,76.83 38.73,77.15 37.78,78.11 35.24,78.11 35.24,76.83 PI_ADC_2.4
ADC4+  (via drill 0.35)
  Top 0.152: U$1.13 151.13,37.78 v147,37.78 | v91.12,9.53 v143.19,9.53 | v84.14,49.53 83.82,49.85 63.5,49.85 62.23,51.12 62.23,55.56 v39.05,55.56
  Bottom 0.152: v147,37.78 147.32,37.47 147.32,32.07 147,31.75 147,13.34 v143.19,9.53 | v91.12,9.53 87.31,13.34 87.31,36.51 84.14,39.69 v84.14,49.53 | v39.05,55.56 39.05,69.22 37.47,70.8 37.47,76.83 PI_ADC_2.5
ADC4-  (via drill 0.35)
  Top 0.152: v147.32,39.05 149.22,39.05 149.86,39.69 U$1.14 | v96.2,10.16 v144.78,10.16 | v89.53,35.88 89.22,36.2 67.31,36.2 65.09,38.42 v54.61,38.42 | v43.81,75.56 41.91,75.56 40.64,76.83 PI_ADC_2.6
  Bottom 0.152: v147.32,39.05 147.64,38.73 147.64,31.75 147.32,31.43 147.32,12.7 v144.78,10.16 | v96.2,10.16 96.2,22.23 89.53,28.89 v89.53,35.88 | v54.61,38.42 49.21,43.81 49.21,70.17 v43.81,75.56
ADC5+  (via drill 0.35)
  Top 0.152: v148.91,48.9 148.27,48.9 147.64,49.53 U$2.1 | v147,10.16 146.37,10.79 91.12,10.79 90.81,10.48 v89.22,10.48 | v68.58,73.66 66.67,75.56 56.52,75.56 55.24,76.83 PI_ADC_3.3
  Bottom 0.152: v148.91,48.9 147.96,47.94 147.96,31.43 147.64,31.11 147.64,10.79 v147,10.16 | v89.22,10.48 86.04,13.65 86.04,16.19 84.14,18.1 76.2,18.1 76.2,23.5 73.03,26.67 73.03,42.55 68.58,46.99 v68.58,73.66
ADC5-  (via drill 0.35)
  Top 0.152: v148.91,47.62 148.27,47.62 147.64,48.26 U$2.2 | v147.96,10.16 146.69,11.43 91.12,11.43 90.81,11.75 72.07,11.75 71.75,11.43 v65.09,11.43
  Bottom 0.152: v148.91,47.62 148.27,46.99 148.27,31.11 147.96,30.8 v147.96,10.16 | v65.09,11.43 61.28,15.24 61.28,51.44 59.69,53.02 59.69,59.05 60.33,59.69 60.33,62.55 58.42,64.45 58.42,76.2 57.78,76.83 PI_ADC_3.4
ADC6+  (via drill 0.35)
  Top 0.152: v134.94,53.02 142.24,53.02 142.24,51.75 146.37,47.62 146.69,47.62 147.32,46.99 U$2.3 | v129.54,64.45 129.22,64.77 127.95,64.77 127,63.82 127,62.23 122.87,62.23 121.92,63.18 121.92,64.77 110.17,64.77 109.54,64.14 107.63,64.14 107,63.5 v61.59,63.5
  Bottom 0.152: v134.94,53.02 134.62,53.34 134.62,58.1 129.54,63.18 v129.54,64.45 | v61.59,63.5 60.96,64.14 60.96,76.2 60.33,76.83 PI_ADC_3.5
ADC6-  (via drill 0.35)
  Top 0.152: U$2.4 145.73,45.72 144.78,44.77 144.78,38.73 v140.97,38.73 | v135.57,20.95 134.3,19.68 109.86,19.68 107.95,17.78 87.31,17.78 85.41,19.68 v81.6,19.68 | v77.79,47.31 76.83,48.26 v64.14,48.26
  Bottom 0.152: v140.97,38.73 137.79,35.56 137.79,24.13 135.57,21.91 v135.57,20.95 | v81.6,19.68 77.79,23.5 v77.79,47.31 | v64.14,48.26 63.5,48.9 63.5,76.2 62.87,76.83 PI_ADC_3.6
ADC7+  (via drill 0.35)
  Top 0.152: v146.05,45.09 151.45,45.09 152.08,45.72 U$2.11 | v145.73,19.68 136.21,19.68 135.89,19.37 110.17,19.37 108.27,17.46 v86.68,17.46
  Bottom 0.152: v146.05,45.09 145.73,44.77 v145.73,19.68 | v86.68,17.46 81.92,22.23 81.92,60.01 82.55,60.64 82.55,71.75 PI_ADC_4.3 | PI_ADC_4.3
ADC7-  (via drill 0.35)
  Top 0.152: v138.43,50.48 142.24,50.48 146.37,46.35 151.45,46.35 152.08,46.99 U$2.12 | v126.68,85.41 126.05,86.04 83.19,86.04 82.87,85.72 81.92,85.72 v81.6,86.04
  Bottom 0.152: v138.43,50.48 137.48,51.44 137.48,55.88 137.79,56.2 137.79,60.01 134.62,63.18 134.62,69.22 126.68,77.15 v126.68,85.41 | v81.6,86.04 80.01,84.45 PI_ADC_4.4 | PI_ADC_4.4
ADC8+  (via drill 0.35)
  Top 0.152: v150.81,48.9 151.45,48.9 152.08,48.26 U$2.13 | v144.15,86.36 143.83,86.04 130.18,86.04 129.86,86.36 v82.55,86.36
  Bottom 0.152: v150.81,48.9 148.27,51.44 148.27,61.59 149.86,63.18 149.86,69.53 144.15,75.25 v144.15,86.36 | PI_ADC_4.5 v82.55,86.36 | PI_ADC_4.5
ADC8-  (via drill 0.35)
  Top 0.152: v154.62,49.85 152.72,49.85 152.4,49.53 U$2.14
  Bottom 0.152: v154.62,49.85 153.99,50.48 153.99,60.33 153.03,61.28 153.03,89.53 143.83,98.74 143.83,102.23 143.51,102.55 76.2,102.55 76.2,100.65 75.25,99.69 75.25,97.79 84.77,88.27 84.77,76.83 PI_ADC_4.6
ADC_1_3V3_P
  Top 0.152: F41.2 10.16,73.03 7.62,75.56 7.62,76.83 PI_ADC_1.2
ADC_1_5V_P
  Top 0.152: F40.2 5.08,73.03 5.08,76.83 PI_ADC_1.1
ADC_2_3V3_P  (via drill 0.35)
  Top 0.152: v31.75,74.3 33.02,73.03 F39.2
  Bottom 0.152: v31.75,74.3 30.16,75.88 30.16,76.83 PI_ADC_2.2
ADC_2_5V_P  (via drill 0.35)
  Top 0.152: v27.94,74.93 27.94,73.03 F38.2
  Bottom 0.152: v27.94,74.93 27.62,75.25 27.62,76.83 PI_ADC_2.1
ADC_3_3V3_P  (via drill 0.35)
  Top 0.152: v56.52,71.12 59.05,71.12 60.33,72.39 F43.2
  Bottom 0.152: v56.52,71.12 52.7,74.93 52.7,76.83 PI_ADC_3.2
ADC_3_5V_P  (via drill 0.35)
  Top 0.152: v51.75,74.61 53.98,72.39 F42.2
  Bottom 0.152: v51.75,74.61 50.16,76.2 50.16,76.83 PI_ADC_3.1
ADC_4_3V3_P
  Top 0.152: PI_ADC_4.2 78.74,73.03 F45.2 | PI_ADC_4.2
ADC_4_5V_P
  Top 0.152: PI_ADC_4.1 73.66,76.83 73.66,73.03 F44.2
FTDI2_3V3
  Top 0.152: C29.2 136.53,49.53 135.57,50.48 133.03,50.48 132.72,50.16 132.72,48.58 132.08,48.58 131.76,48.26 131.76,47.62 U5.17
FTDI2_CBUS1  (via drill 0.35)
  Top 0.152: v90.49,11.11 90.17,11.43 79.69,11.43 79.69,5.08 R23.2 | v95.57,16.19 95.89,16.51 121.28,16.51 v121.92,17.14 | v123.83,50.16 124.14,50.48 126.05,50.48 126.36,50.16 126.36,48.58 127.64,48.58 127.95,48.26 127.95,47.62 U5.23
  Bottom 0.152: v95.57,16.19 v90.49,11.11 | v121.92,17.14 121.92,48.26 v123.83,50.16
FTDI2_RE  (via drill 0.35)
  Top 0.152: U5.14 133.03,40.01 133.03,39.37 132.72,39.05 131.44,39.05 130.81,38.42 R27.1 130.81,38.1 v129.54,38.1 | v129.22,33.66 128.59,33.66 127.95,33.02 U12.2
  Bottom 0.152: v129.22,33.66 129.54,33.97 v129.54,38.1
FTDI2_RXD  (via drill 0.35)
  Top 0.152: v126.05,41.59 127.32,41.59 127.32,40.32 U5.5 | v126.05,34.92 126.68,34.29 U12.1
  Bottom 0.152: v126.05,41.59 126.36,41.27 126.36,35.24 v126.05,34.92
FTDI2_TE  (via drill 0.35)
  Top 0.152: v130.18,41.59 132.4,41.59 132.4,40.32 U5.13 | v130.18,33.66 128.27,31.75 U12.3
  Bottom 0.152: v130.18,33.66 v130.18,41.59
FTDI2_TXD  (via drill 0.35)
  Top 0.152: v123.83,40.64 124.46,40.64 124.78,40.32 U5.1 | v124.14,33.66 127.32,30.48 U12.4
  Bottom 0.152: v123.83,40.64 124.14,40.32 v124.14,33.66
FTDI_3V3  (via drill 0.35)
  Top 0.152: v20.64,4.45 20.95,4.45 21.59,3.81 C16.2 | v21.27,14.92 23.81,17.46 29.84,17.46 31.43,19.05 31.43,20 U6.17 31.43,20.32 31.43,21.27 v48.26,21.27 | 108.9,45.4 107.95,44.45 v103.82,44.45 101.6,44.45 99.69,46.35 97.47,46.35 96.52,47.31 95.25,47.31 94.3,48.26 90.17,48.26 C47.2 90.17,47.94 88.27,46.04 48.9,46.04 v48.58,46.35 | 108.9,45.4 108.9,46.67 U13.17 108.9,46.99 108.9,47.62 109.22,47.94 109.54,47.94 110.49,48.9 C39.2 | v120.65,38.1 123.19,38.1 C43.2 | v120.65,44.13 110.17,44.13 108.9,45.4 | v103.82,35.88 103.82,37.15 U15.17 | v120.65,49.85 120.65,48.26 120.33,47.94 120.33,46.99 U14.17
  Bottom 0.152: v20.64,4.45 21.27,5.08 v21.27,14.92 | v120.65,38.1 v120.65,44.13 v120.65,49.85 | v103.82,44.45 v103.82,35.88 | v48.26,21.27 48.58,21.59 v48.58,46.35
FTID2_CBUS2  (via drill 0.35)
  Top 0.152: v84.45,7.3 79.69,2.54 R24.2 | v85.41,15.88 85.72,15.56 101.28,15.56 101.6,15.88 v121.28,15.88 | v122.24,53.34 122.56,53.02 126.36,53.02 127,52.39 127,50.8 127.32,50.8 127.95,50.16 127.95,48.9 128.59,48.26 128.59,47.62 U5.22
  Bottom 0.152: v84.45,7.3 85.41,8.26 v85.41,15.88 | v121.28,15.88 121.28,50.8 122.24,51.75 v122.24,53.34
GND  (via drill 0.35)
  Top 0.152: 31.43,7.62 28.57,7.62 27.94,6.99 USB3.5 | 31.43,7.62 32.07,7.62 32.38,7.3 C17.1 | 31.43,7.62 29.84,6.03 | 29.84,6.03 29.21,5.4 21.59,5.4 C16.1 21.59,5.08 19.68,5.08 19.37,4.76 J2.G3 19.05,4.76 18.1,5.71 3.81,5.71 | 3.81,5.71 3.81,4.76 J2.G2 | 3.81,5.71 3.81,13.34 | 3.81,13.34 3.81,13.97 J2.G1 3.81,13.34 | 7.94,13.34 7.94,14.61 J2.6 | 3.81,13.34 7.94,13.34 | U6.26 25.72,20.32 26.35,20.32 U6.25 26.35,20 26.35,17.78 | 29.84,19.05 30.48,19.05 30.8,19.37 30.8,20 U6.18 | 29.84,19.05 28.89,19.05 28.89,20 U6.21 | 26.35,17.78 29.53,17.78 29.84,18.1 29.84,19.05 | 21.91,17.78 18.41,14.29 J2.G4 18.1,13.97 15.56,13.97 14.92,13.34 7.94,13.34 | 26.35,17.78 21.91,17.78 | SW3.2 23.5,31.11 22.86,31.11 20,28.26 20,17.78 21.91,17.78 | 85.09,22.86 84.14,23.81 79.38,23.81 79.06,23.5 C3.2 | 65.41,20.95 61.59,20.95 C4.1 | 65.41,20.95 66.67,19.68 U$4.2 66.67,19.37 65.41,18.1 53.02,18.1 U$3.2 | 71.75,20.32 71.12,20.95 65.41,20.95 | 71.75,20.32 C10.- | 85.09,22.86 82.55,20.32 71.75,20.32 | 85.09,22.86 C1.2 | 61.59,13.34 61.59,13.97 Q4.2 | 61.59,13.34 61.59,12.7 60.33,11.43 R40.1 60.01,11.43 58.74,12.7 50.8,12.7 C18.1 50.8,13.02 48.9,13.02 R20.1 48.9,12.7 45.09,12.7 43.18,10.79 J1.CDN 39.05,10.79 | 61.59,13.34 68.9,13.34 69.53,13.97 Q5.1 70.48,13.34 v77.15,13.34 77.79,13.97 U2.4 | v73.34,6.99 71.75,5.4 70.48,5.4 70.48,6.67 USB1.5 | 27.94,11.75 28.26,12.06 28.26,12.7 U6.7 | 27.94,11.75 27.62,11.43 25.08,11.43 24.77,11.11 C15.1 | 27.94,11.75 31.75,11.75 32.38,11.11 C9.1 32.38,10.79 J1.- 39.05,10.79 | 29.84,6.03 31.43,4.45 31.43,2.86 32.7,2.86 33.02,3.17 33.02,4.76 39.05,10.79 | LOPY_UART1.5 44.13,54.29 50.16,54.29 50.48,54.61 59.69,54.61 LOPY_UART0.5
  Top 0.152: PI_ADC_4.7 87.31,76.83 86.04,78.11 66.67,78.11 65.41,76.83 PI_ADC_3.7 | PI_ADC_1.7 20.32,76.83 20.64,77.15 26.35,77.15 27.3,78.11 41.27,78.11 42.55,76.83 PI_ADC_2.7 | U3.P$27 v22.86,56.52 | 103.5,35.24 106.36,35.24 | 106.36,35.24 107,35.24 107.95,36.2 C35.1 | 103.5,35.24 103.19,35.56 103.19,37.15 U15.18 | 103.5,35.24 101.28,35.24 101.28,37.15 U15.21 101.28,37.47 101.28,38.42 97.79,38.42 | 97.79,38.42 97.79,40.64 | 97.79,40.64 97.79,41.27 98.11,41.59 98.74,41.59 99.06,41.27 102.23,41.27 102.23,42.23 101.92,42.55 100.01,42.55 99.38,43.18 R8.2 | 98.42,37.78 98.74,37.47 U15.25 | 98.42,37.78 97.79,38.42 | 98.42,37.78 98.11,37.47 U15.26 | 97.79,40.64 87.95,40.64 86.04,42.55 80.64,42.55 BAT1.- | R13.2 92.08,45.09 93.34,46.35 93.98,46.35 C46.1 93.98,46.67 | 93.98,46.67 95.89,46.67 C48.1 | 103.5,47.31 103.82,46.99 U13.25 | 103.5,47.31 102.87,47.94 102.55,47.94 101.6,48.9 C38.1 101.28,48.9 100.33,49.85 v93.98,49.85 93.03,49.85 92.08,50.8 91.12,50.8 90.17,49.85 C47.1 | 103.5,47.31 105.09,48.9 | 103.5,47.31 103.19,46.99 U13.26 | v93.98,47.62 93.98,46.67 | C33.1 111.76,29.53 110.81,30.48 110.49,30.48 110.17,30.8 110.17,31.43 U$6.1 110.17,31.75 109.54,32.38 107.95,32.38 | 107.95,32.38 106.36,32.38 | 106.36,32.38 100.65,32.38 100.65,30.16 U15.7 | 107.95,32.38 C34.1 | 108.9,48.9 108.9,48.26 108.58,47.94 | 108.58,47.94 108.27,47.62 108.27,46.99 U13.18 | 108.58,47.94 106.36,47.94 106.36,46.99 U13.21 | v106.05,38.1 105.73,38.1 105.73,39.37 U13.7 | v107.95,48.9 108.9,48.9 | 108.9,48.9 C39.1 | 107,53.02 105.41,53.02 104.46,53.98 103.5,53.98 103.19,54.29 PCB1.P$6 | 107,53.02 107.95,52.07 PCB1.P$9
  Top 0.152: 112.08,53.34 111.76,53.02 107,53.02 | 112.08,53.34 113.03,54.29 PCB1.P$14 | 112.08,53.34 118.75,53.34 119.38,53.98 120.33,53.98 120.65,54.29 PCB1.P$20 | v106.36,33.02 106.36,32.38 | v103.82,50.16 105.09,48.9 | 105.09,48.9 C40.1 | v106.36,34.92 106.36,35.24 | v126.68,88.27 126.36,87.95 121.6,87.95 I2C_9.5 | TP7.TP 121.28,62.23 109.86,62.23 J3.2 78.11,62.87 U7.3 | C13.1 136.21,27.3 136.21,29.84 U10.8 133.35,29.84 132.72,30.48 U12.5 132.4,30.48 131.44,29.53 124.14,29.53 122.24,31.43 | 120.65,35.24 120.65,36.2 C36.1 | 120.65,35.24 R28.1 | 125.41,36.2 125.41,38.1 125.09,38.42 124.14,38.42 123.19,39.37 C43.1 123.19,39.69 122.24,40.64 117.16,40.64 117.16,39.69 U14.7 | 122.24,35.24 124.46,35.24 125.41,36.2 | 122.24,35.24 120.65,35.24 | 125.41,36.2 C31.1 | 122.24,31.43 121.28,30.48 C32.2 | 122.24,35.24 122.24,31.43 | 146.37,14.61 146.37,17.46 147.32,18.41 C12.1 | L3.1 146.37,14.61 | v146.05,14.29 146.37,14.61 | U$5.IN- 99.06,4.45 100.65,2.86 136.84,2.86 138.43,4.45 U$5.OUT- | 126.05,47.62 126.68,47.62 U5.25 126.68,47.31 126.68,46.35 128.91,46.35 129.22,46.67 129.22,47.31 U5.21 129.22,47.62 129.22,48.58 131.13,48.58 | U14.25 115.25,46.99 114.62,46.99 U14.26 114.62,46.67 114.62,45.72 113.03,45.72 112.71,46.04 112.71,49.85 116.2,49.85 | 116.84,50.48 116.2,49.85 | 116.2,49.85 115.25,48.9 R15.2 | 120.02,50.48 121.92,50.48 123.19,49.21 C44.1 123.19,48.9 123.51,48.58 126.05,48.58 126.05,47.62 | 120.02,50.48 116.84,50.48 | 120.02,50.48 120.02,48.9 C42.1 119.7,48.9 119.7,46.99 U14.18 | 126.05,47.62 U5.26 | C30.1 133.35,38.1 132.72,37.47 129.22,37.47 128.59,38.1 128.59,40.01 U5.7 128.59,40.32 128.59,41.59 v128.27,41.59
  Top 0.152: C28.1 131.13,49.53 | 131.13,49.53 R26.2 130.18,49.53 130.18,51.12 129.22,51.12 128.59,51.75 PCB1.P$25 | 131.13,48.58 131.13,47.62 U5.18 | 131.13,48.58 131.13,49.53 | v127.64,44.13 122.87,44.13 121.92,45.09 117.79,45.09 117.79,46.67 U14.21 | v134.3,48.58 134.3,48.9 134.94,49.53 C29.1 | PCB1.P$30 133.67,54.61 134.62,55.56 137.48,55.56 138.43,54.61 PCB1.P$34 138.75,54.29 139.7,53.34 144.78,53.34 146.05,52.07 PCB1.P$39 146.37,51.75 147,51.75 151.13,47.62 153.99,47.62 154.31,47.31 C2.1 154.31,46.99 155.26,46.99 | 155.26,46.99 155.26,45.09 155.57,44.77 160.34,44.77 160.66,45.09 C11.1 | 163.51,20.32 163.51,19.05 | 163.51,20.32 163.51,21.59 U8.1 163.83,21.59 v164.47,22.23 | 163.51,20.32 U8.2 | C19.2 172.09,15.88 170.81,17.14 164.47,17.14 163.83,17.78 U8.4 163.51,17.78 163.51,19.05 | 163.51,19.05 U8.3 | 172.72,31.11 172.72,29.84 U1.15 | 172.72,31.11 172.72,32.38 | 172.72,31.11 U1.16 | 172.72,32.38 171.45,32.38 169.54,34.29 v165.42,34.29 164.47,34.29 163.83,34.92 U1.10 v160.34,34.92 | 172.72,32.38 U1.17 | I_UART_HUB_1.5 139.38,76.83 140.65,78.11 151.76,78.11 153.03,76.83 153.03,75.56 155.26,75.56 156.53,76.83 PI_UART_HUB_2.5 156.84,76.83 158.43,75.25 169.23,75.25 169.23,71.44 170.18,70.48 172.09,70.48 172.09,72.39 173.67,73.98 173.99,73.98 PI_UART_HUB_3.5 | 155.26,46.99 155.26,47.94 v157.16,47.94 | v107.95,50.16 108.27,50.48 116.84,50.48 | v76.2,64.77 LOPY_I2C.5
  Bottom 0.152: SW3.2 SW1.2 SW4.2 22.86,45.72 v22.86,56.52 | v73.34,6.99 77.15,10.79 v77.15,13.34 | U$3.2 51.75,17.46 51.75,17.14 47.31,12.7 43.18,12.7 43.18,10.79 J1.CDN | SPI_1.7 20.32,93.03 15.24,87.95 I2C_1.5 15.24,87.63 16.19,86.68 16.19,81.92 20,78.11 20,76.83 PI_ADC_1.7 20.32,76.83 20.32,74.93 20,74.61 20,59.37 U3.P$27 | PI_ADC_4.7 87.31,76.83 86.36,77.79 86.36,87.63 I2C_5.5 86.36,87.95 86.36,99.06 SPI_4.7 | 64.45,95.25 64.45,99.06 SPI_3.7 | 64.45,95.25 64.45,91.76 68.26,87.95 I2C_4.5 | 65.09,76.83 65.09,65.09 LOPY_I2C.5 64.77,47.62 63.82,47.62 63.18,48.26 63.18,51.12 LOPY_UART0.5 | 41.27,78.11 33.02,86.36 33.02,87.63 I2C_2.5 | 41.27,78.11 42.55,76.83 PI_ADC_2.7 42.86,76.83 42.86,75.56 48.26,70.17 48.26,64.77 LOPY_SPI.7 | 41.27,78.11 41.27,78.42 50.48,87.63 I2C_3.5 | SPI_2.7 42.55,99.06 50.48,91.12 50.48,87.95 I2C_3.5 | 54.29,87.63 65.09,76.83 | 54.29,87.63 50.8,87.63 I2C_3.5 | 65.09,76.83 PI_ADC_3.7 | 64.45,95.25 54.29,95.25 54.29,87.63 | v93.98,49.85 v93.98,47.62 | 106.36,38.42 v106.05,38.1 | 106.36,38.42 106.36,48.58 107.31,49.53 | 107.31,49.53 v107.95,50.16 107.95,51.75 PCB1.P$9 | 107.31,49.53 v107.95,48.9 | J8.2 113.35,56.83 113.35,54.61 PCB1.P$14 | 106.36,38.42 v106.36,34.92 v106.36,33.02 | v103.82,50.16 104.14,50.48 104.14,52.39 103.19,53.34 103.19,54.29 PCB1.P$6 103.19,54.61 105.41,56.83 105.41,70.48 105.09,70.8 105.09,76.2 | PI_UART.5 121.6,76.83 121.6,87.63 I2C_9.5 121.28,87.95 117.47,91.76 117.47,96.84 117.16,97.16 115.89,97.16 115.89,96.52 115.57,96.2 108.58,96.2 108.58,99.06 SPI_5.7 108.27,99.06 103.82,94.61 103.82,87.95 I2C_6.5 103.82,87.63 103.82,77.15 104.14,76.83 PI_RS_485.5 104.46,76.83 105.09,76.2
  Bottom 0.152: v126.68,88.27 126.68,95.25 130.49,99.06 SPI_6.7 | U7.26 v76.2,64.77 U7.3 | 105.09,76.2 110.49,70.8 110.49,64.14 J3.2 | 139.06,7.3 138.75,6.99 138.75,4.76 U$5.OUT- | 139.06,7.3 v146.05,14.29 | U10.8 134.94,28.89 134.94,25.4 | 134.94,25.4 134.94,11.43 139.06,7.3 | v128.27,41.59 127.64,42.23 v127.64,44.13 128.27,44.77 128.27,51.75 PCB1.P$25 128.27,52.07 127.32,53.02 127.32,54.93 127.95,55.56 133.35,55.56 133.35,54.61 PCB1.P$30 133.67,54.29 133.67,53.34 134.62,52.39 134.62,48.9 v134.3,48.58 134.3,46.35 136.21,46.35 137.48,45.09 137.48,25.4 134.94,25.4 | U$7.4 173.35,76.2 PI_UART_HUB_3.5 173.99,87.31 174.31,87.63 I2C_10.5 174.62,87.95 174.62,99.06 SPI_8.7 | v164.47,22.23 165.42,23.18 v165.42,34.29 | I_UART_HUB_1.5 139.06,76.83 139.06,87.63 I2C_8.5 | 156.84,76.83 J7.5 J7.2 157.8,63.18 157.8,47.94 | 156.84,76.83 156.84,87.63 I2C_7.5 156.84,87.95 153.35,91.44 153.35,98.42 152.72,99.06 SPI_7.7 | 156.84,76.83 PI_UART_HUB_2.5 | v160.34,34.92 157.8,37.47 157.8,47.94 | 157.8,47.94 v157.16,47.94
GNDA  (via drill 0.35)
  Top 0.152: U$1.5 U$1.10 154.94,40.01 156.21,40.01 | L3.2 154.62,14.61 v154.62,16.51 154.62,17.78 C14.1 | 157.16,47.31 158.12,47.31 C7.1 | 157.16,47.31 156.21,47.31 C6.1 | 156.21,42.86 154.31,42.86 | 154.31,42.86 153.99,43.18 U$2.9 150.81,43.18 149.86,44.13 147.96,44.13 147.64,44.45 U$2.5 | 154.31,42.86 C5.2 | v157.16,46.35 157.16,47.31 | v157.16,43.18 156.84,42.86 156.21,42.86 | 156.21,42.86 C8.2 156.21,40.01 | 156.21,40.01 U$1.9
  Bottom 0.152: v157.16,46.35 v157.16,43.18 157.16,19.05 v154.62,16.51
GPIO4  (via drill 0.35)
  Top 0.152: v168.59,57.47 171.45,57.47 R16.1 171.45,55.24 172.4,55.24 172.4,53.34 171.45,52.39 158.43,52.39 v157.16,51.12 | v106.36,23.81 107.95,22.23 135.25,22.23 137.16,20.32 v148.59,20.32
  Bottom 0.152: v168.59,57.47 168.28,57.78 U$7.2 | v106.36,23.81 105.09,25.08 105.09,51.44 105.41,51.75 PCB1.P$7 | v148.59,20.32 153.67,25.4 153.67,46.99 157.16,50.48 v157.16,51.12
ID_SC  (via drill 0.35)
  Top 0.152: 168.28,20.64 168.59,20.95 172.09,20.95 R37.1 | 168.28,20.64 168.28,19.05 U8.6 | 168.28,20.64 165.1,23.81 133.67,23.81 v133.35,23.5
  Bottom 0.152: v133.35,23.5 131.13,25.72 131.13,50.48 132.08,51.44 132.08,52.39 131.13,53.34 131.13,54.29 PCB1.P$28
ID_SD  (via drill 0.35)
  Top 0.152: U8.5 165.74,17.78 165.74,21.91 164.78,22.86 164.15,22.86 163.83,22.54 161.93,22.54 160.66,21.27 R38.1 160.66,20.95 159.7,20.95 v159.38,20.64
  Bottom 0.152: v159.38,20.64 157.48,18.73 157.48,17.78 144.78,5.08 144.78,3.17 137.16,3.17 136.84,3.49 136.84,6.67 130.81,12.7 130.81,51.75 PCB1.P$27
LOPY_3V3  (via drill 0.35)
  Top 0.152: F56.2 F56.1 131.13,26.67 130.18,27.62 v129.22,27.62 | v127,68.9 109.54,68.9 J4.1 108.27,69.53 105.41,69.53 104.46,70.48 80.01,70.48 78.74,69.22 U7.25 | F83.1 39.05,49.53 40.96,47.62 52.39,47.62 54.29,49.53 F81.1 54.93,49.53 v56.52,47.94 | 58.42,60.96 59.69,62.23 72.39,62.23 U7.2 74.93,59.69 77.47,59.69 U7.4 | F77.2 F77.1 41.59,71.75 40.01,73.34 v36.83,73.34 | U3.P$26 20,55.88 | 20,55.88 18.41,55.88 17.46,56.83 v10.79,56.83 2.22,56.83 2.22,58.74 7.3,63.82 28.57,63.82 28.57,65.41 28.89,65.72 29.21,65.72 29.21,66.67 R22.2 30.48,66.67 v30.8,66.99 | v10.48,29.84 10.48,14.61 J2.4 | 31.43,62.55 33.02,60.96 F75.1 | 31.43,62.55 21.27,62.55 20,61.28 20,55.88 | 31.43,62.55 41.59,62.55 42.23,61.91 46.99,61.91 47.62,62.55 56.52,62.55 58.1,60.96 F79.1 58.42,60.96 | v59.69,60.01 58.74,60.96 58.42,60.96